# Altium schematic sheet RFR24 AMS Design - Thermistors V1.SchDoc
size A; SheetNumber: 8; SheetTotal: 10
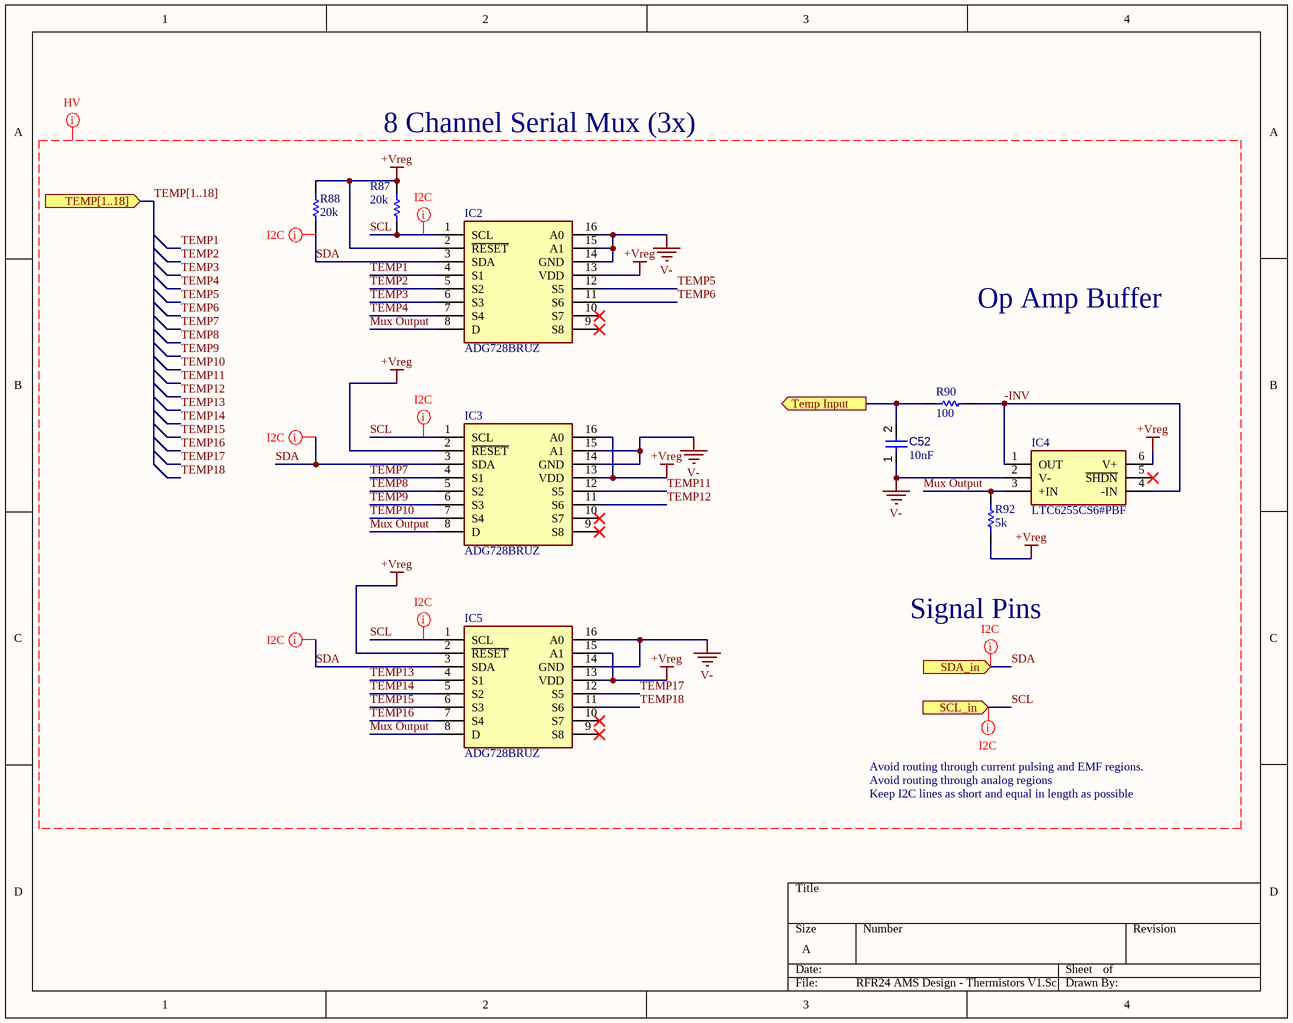
[diagram p0: RFR24 AMS Design - Thermistors V1.SchDoc]

## Parts
C52  value 10nF  [CAPC2013X145X50LL20T25]  (hidden comment: Capacitor 1 uF +/- 10% 25 V 0805)
IC2  ADG728BRUZ  [SOP65P640X120-16N]
IC3  ADG728BRUZ  [SOP65P640X120-16N]
IC4  LTC6255CS6#PBF  [SOT95P280X100-6N]
IC5  ADG728BRUZ  [SOP65P640X120-16N]
R87  value 20k  [RESC2013X70X40LL20T20]  (hidden comment: Resistor 1k +/-1% 0805 125 mW)
R88  value 20k  [RESC2013X70X40LL20T20]  (hidden comment: Resistor 1k +/-1% 0805 125 mW)
R90  value 100  [RESC2013X70X40LL20T20]  (hidden comment: Resistor 1k +/-1% 0805 125 mW)
R92  value 5k  [RESC2013X70X40LL20T20]  (hidden comment: Resistor 1k +/-1% 0805 125 mW)

## Ports
SCL_in (in), SDA_in (in), Temp Input (out), TEMP[1..18] (in)

## Nets
+Vreg: IC2.2(~{RESET}) IC2.13(VDD) IC3.2(~{RESET}) IC3.13(VDD) IC3.16(A0) IC4.6(V+) IC5.2(~{RESET}) IC5.13(VDD) IC5.15(A1) R87.2 R88.2 R92.1
V-: C52.1 IC2.14(GND) IC2.15(A1) IC2.16(A0) IC3.14(GND) IC3.15(A1) IC4.2(V-) IC5.14(GND) IC5.16(A0)
-INV: IC4.1(OUT) IC4.4(-IN) R90.1
Mux Output: IC2.8(D) IC3.8(D) IC4.3(+IN) IC5.8(D) R92.2
SCL: IC2.1(SCL) IC3.1(SCL) IC5.1(SCL) R87.1 ; port SCL_in
SDA: IC2.3(SDA) IC3.3(SDA) IC5.3(SDA) R88.1 ; port SDA_in
TEMP1: IC2.4(S1)
TEMP2: IC2.5(S2)
TEMP3: IC2.6(S3)
TEMP4: IC2.7(S4)
TEMP5: IC2.12(S5)
TEMP6: IC2.11(S6)
TEMP7: IC3.4(S1)
TEMP8: IC3.5(S2)
TEMP9: IC3.6(S3)
TEMP10: IC3.7(S4)
TEMP11: IC3.12(S5)
TEMP12: IC3.11(S6)
TEMP13: IC5.4(S1)
TEMP14: IC5.5(S2)
TEMP15: IC5.6(S3)
TEMP16: IC5.7(S4)
TEMP17: IC5.12(S5)
TEMP18: IC5.11(S6)
Temp Input: C52.2 R90.2 ; port Temp Input

Not connected (* = marked no-connect by the designer): IC2 9(S8)* 10(S7)*; IC3 9(S8)* 10(S7)*; IC4 5(~{SHDN})*; IC5 9(S8)* 10(S7)*

## Buses and harness runs
bus TEMP[1..18] = port TEMP[1..18]

## Layout directives
net class HV: +Vreg, -INV, Mux Output, SCL, SDA, TEMP1, TEMP2, TEMP3, TEMP4, TEMP5, TEMP6, TEMP7, TEMP8, TEMP9, TEMP10, TEMP11, TEMP12, TEMP13, TEMP14, TEMP15, TEMP16, TEMP17, TEMP18, TEMP[1..18], V-
rule Matched Net Lengths [Tolerance = 1000mil]; net class I2C: SCL, SDA

## Notes on the sheet
- 8 Channel Serial Mux (3x)
- Op Amp Buffer
- Signal Pins
- Avoid routing through current pulsing and EMF regions.
- Keep I2C lines as short and equal in length as possible
- Avoid routing through analog regions

## Library data of the parts
C52 = CMP-001-00010-6: Chip Capacitor, 1 uF, +/-10%, 25 V, 0805 (2012 Metric); Capacitor Type: Ceramic; Voltage Rating: 25V; RoHS Compliant: True; Pins: 2; Mounting Technology: SM; Max Operating Temperature: 125°C; Min Operating Temperature: -55°C; Tolerance: 10%; Case/Package: 0805
IC2 IC3 IC5 = ADG728BRUZ: Integrated Circuit; Manufacturer_Name: Analog Devices; Datasheet Link: http://www.analog.com/static/imported-files/data_sheets/ADG728_729.pdf; Height: 1.2mm; Manufacturer_Part_Number: ADG728BRUZ; Mouser Part Number: 584-ADG728BRUZ; Mouser Price/Stock: https://www.mouser.co.uk/ProductDetail/Analog-Devices/ADG728BRUZ?qs=BpaRKvA4VqGXEyZecHfmEg%3D%3D; Arrow Part Number: ADG728BRUZ; Arrow Price/Stock: https://www.arrow.com/en/products/adg728bruz/analog-devices?region=europe
IC4 = LTC6255CS6#PBF: Integrated Circuit; Manufacturer_Name: Analog Devices; Datasheet Link: https://eu.mouser.com/ProductDetail/Analog-Devices/LTC6255CS6PBF?qs=hVkxg5c3xu%252Bj7bFOzXeTRA%3D%3D; Height: 1mm; Manufacturer_Part_Number: LTC6255CS6#PBF
R87 R88 R90 R92 = CMP-009-00010-5: Chip Resistor, 1 KOhm, +/- 1%, 0.125 W, -55 to 155 degC, 0805 (2013 Metric); Power: 125mW; Voltage Rating: 150V; Tolerance: 1%; RoHS Compliant: True; Mounting Technology: SM; Pins: 2; Case/Package: 0805; Max Operating Temperature: 155°C; Min Operating Temperature: -55°C